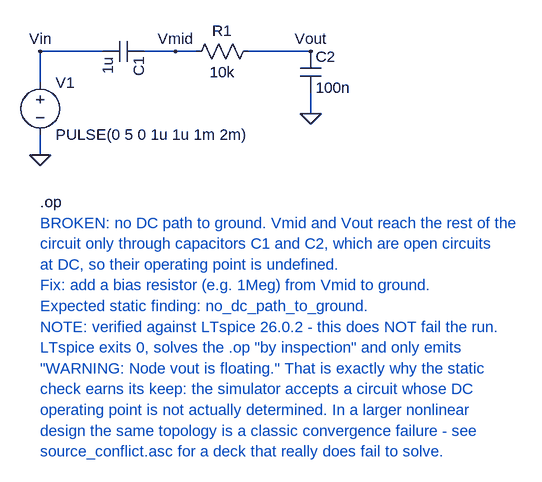
[diagram p0: schematic no_dc_path.asc]
no_dc_path.asc, the LTspice schematic file:
Version 4.1
SHEET 1 880 680
WIRE 0 -32 96 -32
WIRE 160 -32 240 -32
WIRE 320 -32 416 -32
WIRE 0 16 0 -32
WIRE 0 128 0 96
WIRE 416 32 416 64
FLAG 0 128 0
FLAG 416 64 0
FLAG 0 -32 Vin
FLAG 208 -32 Vmid
FLAG 416 -32 Vout
SYMBOL voltage 0 0 R0
WINDOW 123 24 124 Left 2
WINDOW 39 0 0 Left 0
SYMATTR InstName V1
SYMATTR Value PULSE(0 5 0 1u 1u 1m 2m)
SYMBOL cap 160 -48 R90
SYMATTR InstName C1
SYMATTR Value 1u
SYMBOL res 336 -48 R90
WINDOW 0 0 56 VBottom 2
WINDOW 3 32 56 VTop 2
SYMATTR InstName R1
SYMATTR Value 10k
SYMBOL cap 400 -32 R0
SYMATTR InstName C2
SYMATTR Value 100n
TEXT 0 200 Left 2 !.op
TEXT 0 232 Left 2 ;BROKEN: no DC path to ground. Vmid and Vout reach the rest of the
TEXT 0 264 Left 2 ;circuit only through capacitors C1 and C2, which are open circuits
TEXT 0 296 Left 2 ;at DC, so their operating point is undefined.
TEXT 0 328 Left 2 ;Fix: add a bias resistor (e.g. 1Meg) from Vmid to ground.
TEXT 0 360 Left 2 ;Expected static finding: no_dc_path_to_ground.
TEXT 0 392 Left 2 ;NOTE: verified against LTspice 26.0.2 - this does NOT fail the run.
TEXT 0 424 Left 2 ;LTspice exits 0, solves the .op "by inspection" and only emits
TEXT 0 456 Left 2 ;"WARNING: Node vout is floating." That is exactly why the static
TEXT 0 488 Left 2 ;check earns its keep: the simulator accepts a circuit whose DC
TEXT 0 520 Left 2 ;operating point is not actually determined. In a larger nonlinear
TEXT 0 552 Left 2 ;design the same topology is a classic convergence failure - see
TEXT 0 584 Left 2 ;source_conflict.asc for a deck that really does fail to solve.

The netlist it stands for:
* no_dc_path.asc
V1 Vin 0 PULSE(0 5 0 1u 1u 1m 2m)
C1 Vmid Vin 1u
R1 Vout Vmid 10k
C2 Vout 0 100n
.op
* BROKEN: no DC path to ground. Vmid and Vout reach the rest of the
* circuit only through capacitors C1 and C2, which are open circuits
* at DC, so their operating point is undefined.
* Fix: add a bias resistor (e.g. 1Meg) from Vmid to ground.
* Expected static finding: no_dc_path_to_ground.
* NOTE: verified against LTspice 26.0.2 - this does NOT fail the run.
* LTspice exits 0, solves the .op "by inspection" and only emits
* "WARNING: Node vout is floating." That is exactly why the static
* check earns its keep: the simulator accepts a circuit whose DC
* operating point is not actually determined. In a larger nonlinear
* design the same topology is a classic convergence failure - see
* source_conflict.asc for a deck that really does fail to solve.
.backanno
.end